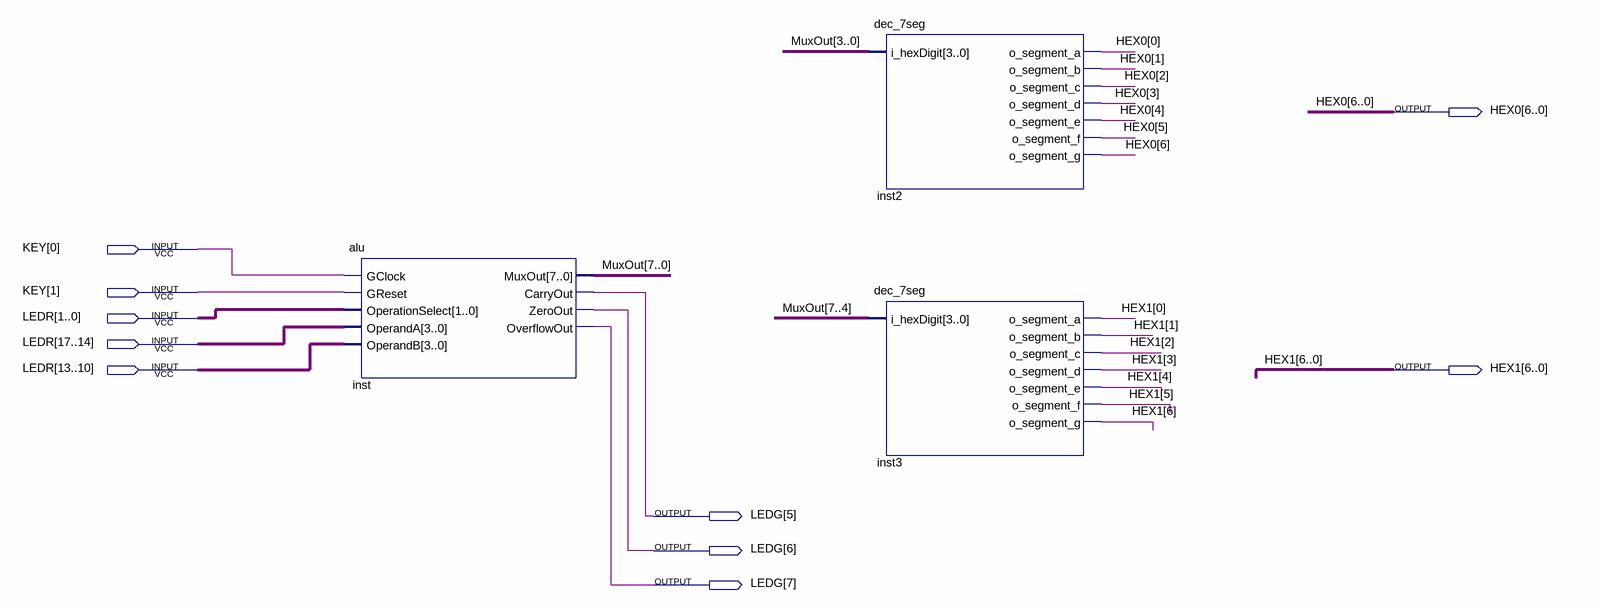
[diagram p0: schematic sheet]
// Quartus schematic alu_top.bdf as structural Verilog: 3 symbols, 10 pins
module alu_top (
  input  [1:0] KEY,
  input  [17:0] LEDR,
  output [6:0] HEX0,
  output [6:0] HEX1,
  output [7:5] LEDG
);

  wire [7:0] MuxOut;

  alu inst (
    .GClock(KEY[0]), .GReset(KEY[1]), .OperationSelect(LEDR[1:0]), .OperandA(LEDR[17:14]),
    .OperandB(LEDR[13:10]), .MuxOut(MuxOut), .CarryOut(LEDG[5]), .ZeroOut(LEDG[6]), .OverflowOut(LEDG[7]));
  dec_7seg inst2 (
    .i_hexDigit(MuxOut[3:0]), .o_segment_a(HEX0[0]), .o_segment_b(HEX0[1]), .o_segment_c(HEX0[2]),
    .o_segment_d(HEX0[3]), .o_segment_e(HEX0[4]), .o_segment_f(HEX0[5]), .o_segment_g(HEX0[6]));
  dec_7seg inst3 (
    .i_hexDigit(MuxOut[7:4]), .o_segment_a(HEX1[0]), .o_segment_b(HEX1[1]), .o_segment_c(HEX1[2]),
    .o_segment_d(HEX1[3]), .o_segment_e(HEX1[4]), .o_segment_f(HEX1[5]), .o_segment_g(HEX1[6]));
endmodule
